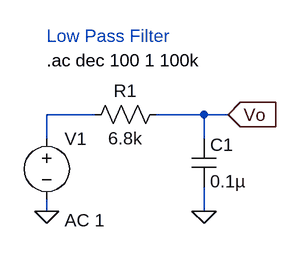
[diagram p0: schematic low_pass_filter.asc]
low_pass_filter.asc, the LTspice schematic file:
Version 4
SHEET 1 880 680
WIRE 144 176 80 176
WIRE 288 176 224 176
WIRE 320 176 288 176
WIRE 80 208 80 176
WIRE 288 208 288 176
WIRE 80 304 80 288
WIRE 288 304 288 272
FLAG 80 304 0
FLAG 288 304 0
FLAG 320 176 Vo
IOPIN 320 176 In
SYMBOL res 240 160 R90
WINDOW 0 0 56 VBottom 2
WINDOW 3 32 56 VTop 2
SYMATTR InstName R1
SYMATTR Value 6.8k
SYMBOL cap 272 208 R0
SYMATTR InstName C1
SYMATTR Value 0.1µ
SYMBOL voltage 80 192 R0
WINDOW 123 24 124 Left 2
WINDOW 39 0 0 Left 0
SYMATTR Value2 AC 1
SYMATTR InstName V1
SYMATTR Value ""
TEXT 80 72 Left 2 ;Low Pass Filter
TEXT 80 104 Left 2 !.ac dec 100 1 100k

The netlist it stands for:
* low_pass_filter.asc
R1 Vo N001 6.8k
C1 Vo 0 0.1µ
V1 N001 0 AC 1
* Low Pass Filter
.ac dec 100 1 100k
.backanno
.end